# Altium schematic sheet sensor_specific.SchDoc
size A4
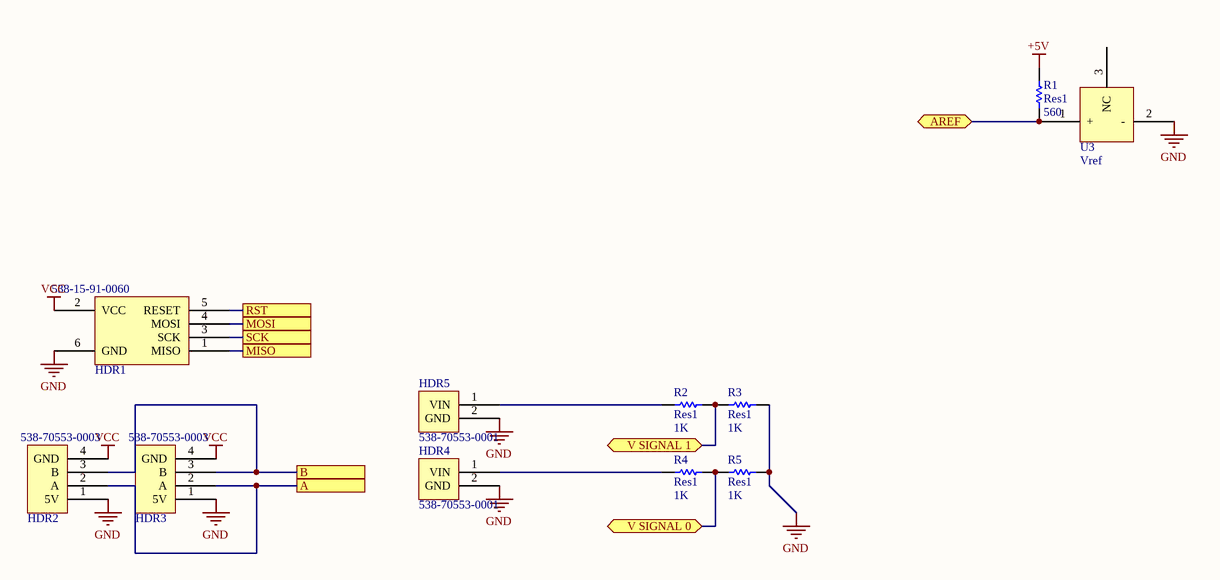
[diagram p0: sensor_specific.SchDoc]

## Parts
HDR1  Supplier Part Number 1: 538-15-91-0060  [MOLEX_HEADER_6_SMD]  (hidden comment: Programming header)
HDR2  Supplier Part Number 1: 538-70553-0003  [MOLEX_HEADER_4H_SHRD]  (hidden comment: RS-485 interface)
HDR3  Supplier Part Number 1: 538-70553-0003  [MOLEX_HEADER_4H_SHRD]  (hidden comment: RS-485 interface)
HDR4  Supplier Part Number 1: 538-70553-0001  [MOLEX_HEADER_2H_SHRD]  (hidden comment: MOLEX_HEADER_2H_SHRD)
HDR5  Supplier Part Number 1: 538-70553-0001  [MOLEX_HEADER_2H_SHRD]  (hidden comment: MOLEX_HEADER_2H_SHRD)
R1  Res1  value 560  [6-0805_N]
R2  Res1  value 1K  [J1-0603]
R3  Res1  value 1K  [J1-0603]
R4  Res1  value 1K  [J1-0603]
R5  Res1  value 1K  [J1-0603]
U3  Vref  [SOT23_N]

## Ports
A, AREF, B, MISO, MOSI, RST, SCK, V SIGNAL 0, V SIGNAL 1

## Nets
+5V: R1.2
GND: HDR1.6(GND) HDR2.1(5V) HDR3.1(5V) HDR4.2(GND) HDR5.2(GND) R3.2 R5.2 U3.2(-)
VCC: HDR1.2(VCC) HDR2.4(GND) HDR3.4(GND)
A: HDR2.2(A) HDR3.2(A) ; port A
AREF: R1.1 U3.1(+) ; port AREF
B: HDR2.3(B) HDR3.3(B) ; port B
MISO: HDR1.1(MISO) ; port MISO
MOSI: HDR1.4(MOSI) ; port MOSI
RST: HDR1.5(RESET) ; port RST
SCK: HDR1.3(SCK) ; port SCK
V SIGNAL 0: R4.2 R5.1 ; port V SIGNAL 0
V SIGNAL 1: R2.2 R3.1 ; port V SIGNAL 1
NetHDR4_1: HDR4.1(VIN) R4.1
NetHDR5_1: HDR5.1(VIN) R2.1

Not connected (* = marked no-connect by the designer): U3 3(NC)

## Library data of the parts
HDR1 = PRGM_HDR: Supplier 1: Mouser
HDR2 HDR3 = MABSS_RS485: Part Number: 70553-0003. MABSS connector; Supplier 1: Mouser
HDR4 HDR5 = MOLEX_HEADER_2H_SHRD: Part Number: 70553-0001. 2-wire signal inputs; Supplier 1: Mouser
R1-R5 = Res1: Resistor; Published: 8-Jun-2000; LatestRevisionDate: 17-Jul-2002; LatestRevisionNote: Re-released for DXP Platform.; PackageReference: AXIAL-0.3; Publisher: Altium Limited; PackageDescription: Axial Device, Thru-Hole; 2 Leads; 0.3 in Pin Spacing